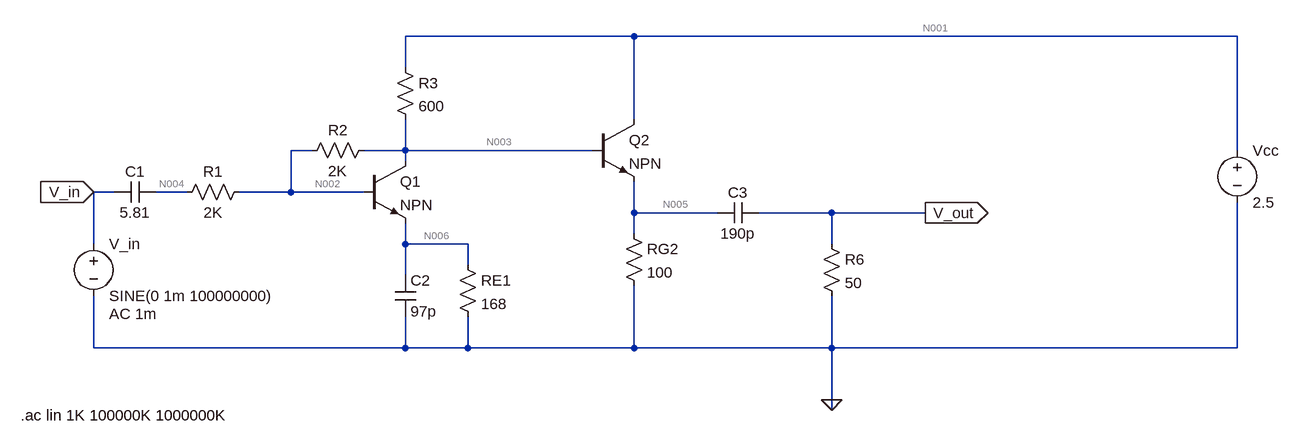
[diagram p0: schematic 2.asc]
2.asc, the LTspice schematic file:
Version 4
SHEET 1 1760 680
WIRE 768 -64 416 -64
WIRE 1696 -64 768 -64
WIRE 416 -16 416 -64
WIRE 768 64 768 -64
WIRE 272 112 240 112
WIRE 416 112 416 64
WIRE 416 112 352 112
WIRE 704 112 416 112
WIRE 1696 112 1696 -64
WIRE 416 128 416 112
WIRE -32 176 -64 176
WIRE 80 176 32 176
WIRE 240 176 240 112
WIRE 240 176 160 176
WIRE 352 176 240 176
WIRE 768 208 768 160
WIRE 896 208 768 208
WIRE 1072 208 960 208
WIRE 1216 208 1072 208
WIRE 768 240 768 208
WIRE -64 256 -64 176
WIRE 416 256 416 224
WIRE 512 256 416 256
WIRE 1072 256 1072 208
WIRE 512 288 512 256
WIRE 416 304 416 256
WIRE -64 416 -64 336
WIRE 416 416 416 368
WIRE 416 416 -64 416
WIRE 512 416 512 368
WIRE 512 416 416 416
WIRE 768 416 768 320
WIRE 768 416 512 416
WIRE 1072 416 1072 336
WIRE 1072 416 768 416
WIRE 1696 416 1696 192
WIRE 1696 416 1072 416
WIRE 1072 496 1072 416
WIRE 1072 512 1072 496
FLAG 1216 208 V_out
IOPIN 1216 208 Out
FLAG -64 176 V_in
IOPIN -64 176 In
FLAG 1072 496 0
SYMBOL res 176 160 R90
WINDOW 0 0 56 VBottom 2
WINDOW 3 32 56 VTop 2
SYMATTR InstName R1
SYMATTR Value 2K
SYMBOL res 368 96 R90
WINDOW 0 0 56 VBottom 2
WINDOW 3 32 56 VTop 2
SYMATTR InstName R2
SYMATTR Value 2K
SYMBOL npn 352 128 R0
SYMATTR InstName Q1
SYMBOL res 400 -32 R0
SYMATTR InstName R3
SYMATTR Value 600
SYMBOL res 496 272 R0
SYMATTR InstName RE1
SYMATTR Value 168
SYMBOL npn 704 64 R0
SYMATTR InstName Q2
SYMBOL res 752 224 R0
SYMATTR InstName RG2
SYMATTR Value 100
SYMBOL res 1056 240 R0
SYMATTR InstName R6
SYMATTR Value 50
SYMBOL voltage 1696 96 R0
WINDOW 123 0 0 Left 0
WINDOW 39 0 0 Left 0
SYMATTR InstName Vcc
SYMATTR Value 2.5
SYMBOL voltage -64 240 R0
WINDOW 123 24 124 Left 2
WINDOW 39 0 0 Left 0
SYMATTR Value2 AC 1m
SYMATTR InstName V_in
SYMATTR Value SINE(0 1m 100000000)
SYMBOL cap 960 192 R90
WINDOW 0 0 32 VBottom 2
WINDOW 3 32 32 VTop 2
SYMATTR InstName C3
SYMATTR Value 190p
SYMBOL cap 32 160 R90
WINDOW 0 0 32 VBottom 2
WINDOW 3 32 32 VTop 2
SYMATTR InstName C1
SYMATTR Value 5.81
SYMBOL cap 400 304 R0
SYMATTR InstName C2
SYMATTR Value 97p
TEXT -176 520 Left 2 !.ac lin 1K 100000K 1000000K

The netlist it stands for:
* 2.asc
R1 N002 N004 2K
R2 N003 N002 2K
Q1 N003 N002 N006 0 NPN
R3 N001 N003 600
RE1 N006 0 168
Q2 N001 N003 N005 0 NPN
RG2 N005 0 100
R6 V_out 0 50
Vcc N001 0 2.5
V_in V_in 0 SINE(0 1m 100000000) AC 1m
C3 V_out N005 190p
C1 N004 V_in 5.81
C2 N006 0 97p
.model NPN NPN
.model PNP PNP
.lib standard.bjt
.ac lin 1K 100000K 1000000K
.backanno
.end

* Results of the author's LTspice run, read from the files saved beside the schematic
* Operating Point, zero values left out:
*   V(n002) = 1.153 V
*   V(n004) = 1.153 V
*   V(n003) = 1.195 V
*   V(n006) = 359 mV
*   V(n001) = 2.5 V
*   V(n005) = 386 mV
*   Ic(Q2) = 3.822 mA
*   Ib(Q2) = 38.22 µA
*   Ie(Q2) = -3.86 mA
*   Ic(Q1) = 2.116 mA
*   Ib(Q1) = 21.16 µA
*   Ie(Q1) = -2.137 mA
*   I(C1) = 6.697 pA
*   I(Rg2) = 3.86 mA
*   I(Re1) = 2.137 mA
*   I(R3) = 2.175 mA
*   I(R2) = 21.16 µA
*   I(R1) = 6.697 pA
*   I(V_in) = 6.697 pA
*   I(Vcc) = -5.997 mA
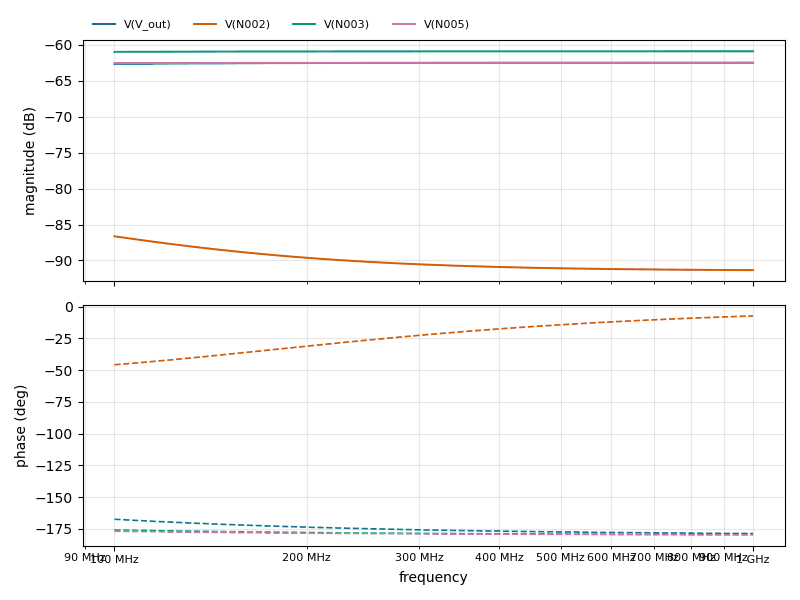
[diagram p1: AC Analysis of 2.asc, plotted from the saved traces]
* AC Analysis, 1 run:
*   V(V_out): -62.66 dB at 100 MHz, -62.48 dB at 1 GHz, peak -62.48 dB at 1 GHz
*   V(N002): -86.64 dB at 100 MHz, -91.35 dB at 1 GHz, peak -86.64 dB at 100 MHz, 3 dB below the peak at 201.2 MHz
*   V(N003): -60.97 dB at 100 MHz, -60.89 dB at 1 GHz, peak -60.89 dB at 1 GHz
*   V(N005): -62.54 dB at 100 MHz, -62.48 dB at 1 GHz, peak -62.48 dB at 1 GHz